# EAGLE design ecu2_telemetria (EAGLE 9.0.0)
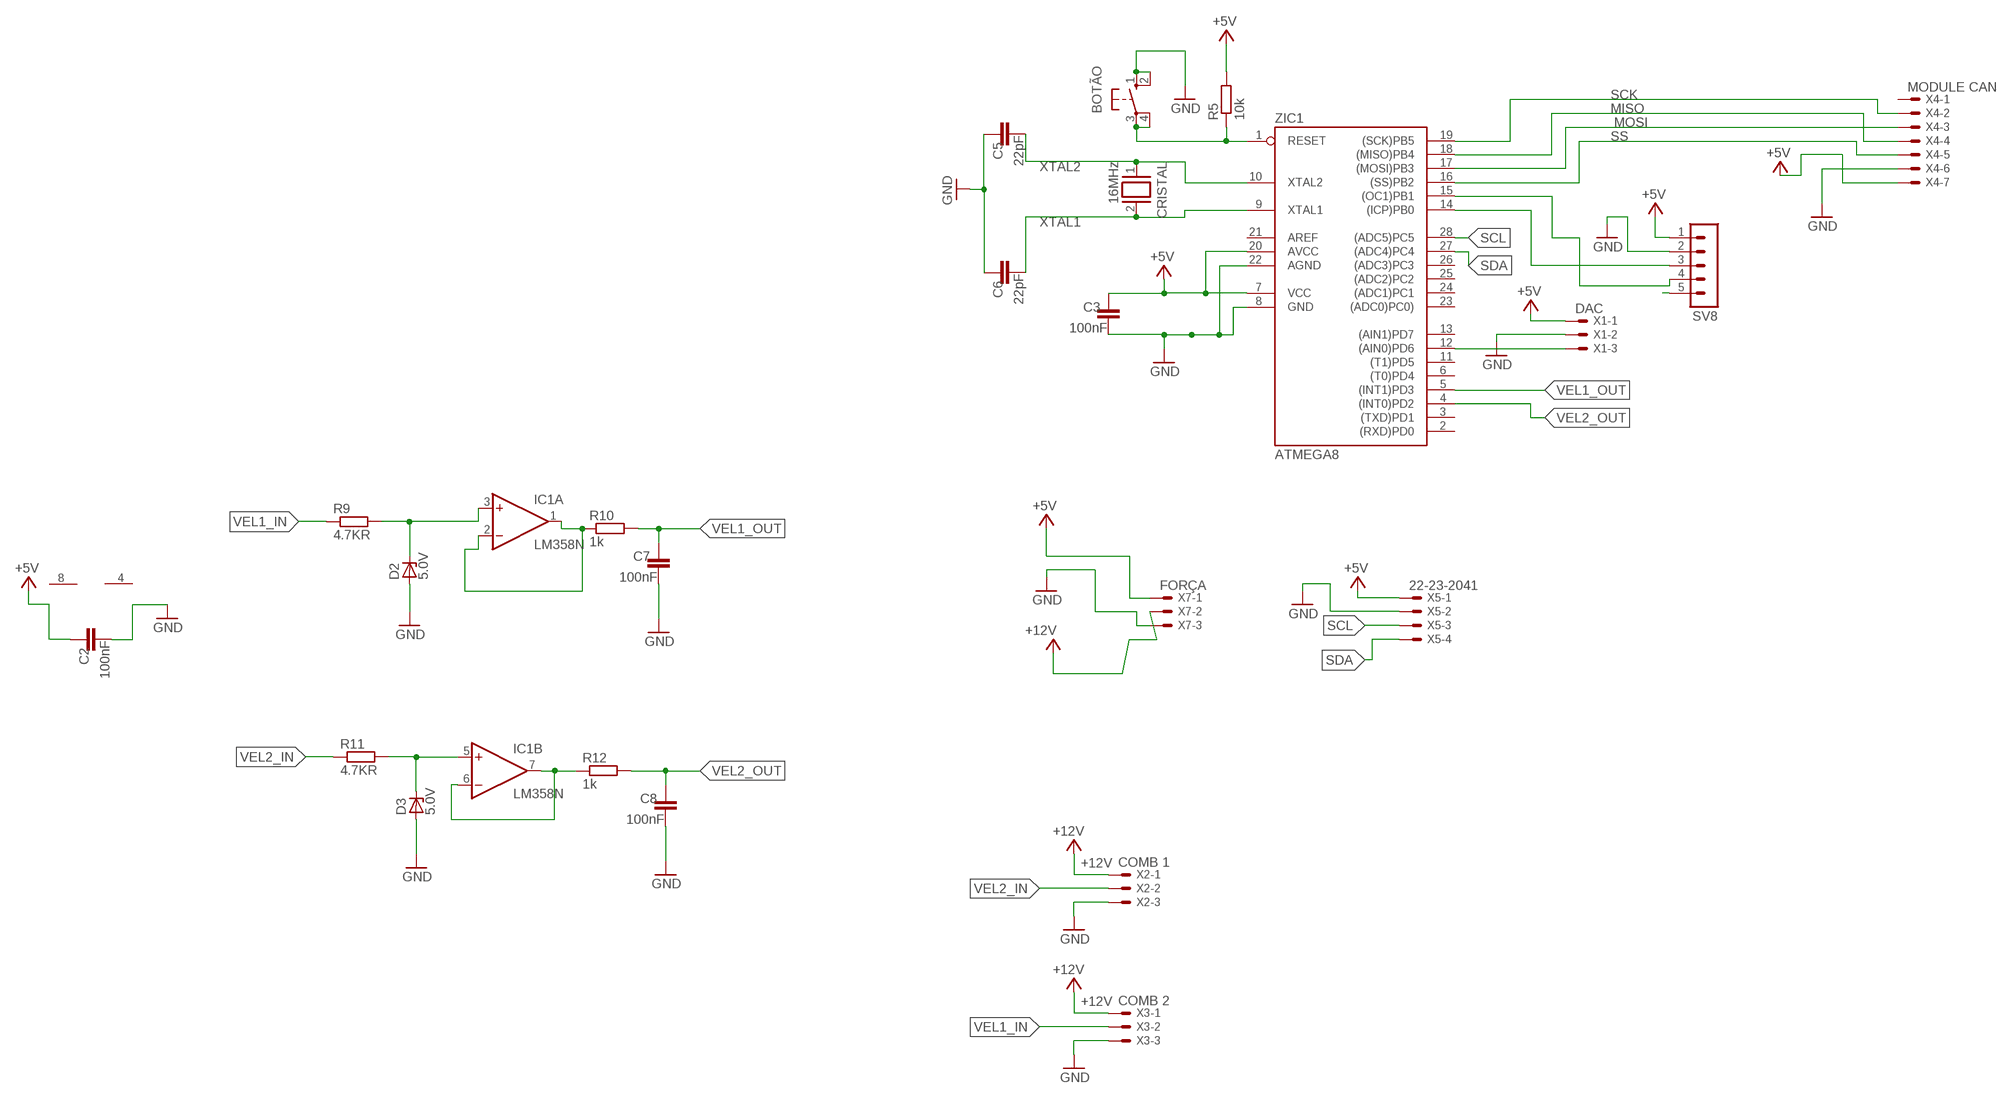
[diagram p0: schematic, sheet 1]

## Parts
BOTÃO  10-XX  [B3F-10XX]
C2  100nF  C5/2.5  [C5B2.5]
C3  100nF  C5/2.5  [C5B2.5]
C5  22pF  C5/2.5  [C5B2.5]
C6  22pF  C5/2.5  [C5B2.5]
C7  100nF  C5/2.5  [C5B2.5]
C8  100nF  C5/2.5  [C5B2.5]
CRISTAL  16MHz  XTAL/S  [QS]
D2  5.0V  ZENER-DIODEDO34-7  [DO34Z7]
D3  5.0V  ZENER-DIODEDO34-7  [DO34Z7]
IC1  LM358N  [DIL08]
R5  10k  R-EU_0207/7  [0207/7]
R9  4.7KR  R-EU_0207/7  [0207/7]
R10  1k  R-EU_0207/7  [0207/7]
R11  4.7KR  R-EU_0207/7  [0207/7]
R12  1k  R-EU_0207/7  [0207/7]
SV8  MA05-1  [MA05-1]
X1  DAC  22-23-2031  [22-23-2031]
X2  COMB 1  22-23-2031  [22-23-2031]
X3  COMB 2  22-23-2031  [22-23-2031]
X4  MODULE CAN  22-23-2071  [22-23-2071]
X5  22-23-2041  [22-23-2041]
X7  FORÇA  22-23-2031  [22-23-2031]
ZIC1  ATMEGA8  AT90S4433P  [DIL28-3]

## Nets
+5V: C2.2 C3.2 R5.2 SV8.1 X1.1 X4.7 X5.1 X7.1 ZIC1.7(VCC) ZIC1.20(AVCC)
+12V: X2.1 X3.1 X7.2
GND: BOTÃO.1(S) BOTÃO.2(S1) C2.1 C3.1 C5.2 C6.2 C7.1 C8.1 D2.A D3.A SV8.2 X1.2 X2.3 X3.3 X4.6 X5.2 X7.3 ZIC1.8(GND) ZIC1.22(AGND)
IO8: SV8.3 ZIC1.14((ICP)PB0)
IO9: SV8.4 ZIC1.15((OC1)PB1)
MISO: X4.4 ZIC1.18((MISO)PB4)
MOSI: X4.3 ZIC1.17((MOSI)PB3)
N$3: X1.3 ZIC1.12((AIN0)PD6)
N$5: D2.C IC1.3(A:+IN) R9.2
N$6: SV8.5
N$9: BOTÃO.3(P) BOTÃO.4(P1) R5.1 ZIC1.1(RESET)
N$12: IC1.1(A:OUT) IC1.2(A:-IN) R10.1
N$13: D3.C IC1.5(B:+IN) R11.2
N$14: IC1.6(B:-IN) IC1.7(B:OUT) R12.1
SCK: X4.2 ZIC1.19((SCK)PB5)
SCL: X5.3 ZIC1.28((ADC5)PC5)
SDA: X5.4 ZIC1.27((ADC4)PC4)
SS: X4.5 ZIC1.16((SS)PB2)
VEL1_IN: R9.1 X3.2
VEL1_OUT: C7.2 R10.2 ZIC1.5((INT1)PD3)
VEL2_IN: R11.1 X2.2
VEL2_OUT: C8.2 R12.2 ZIC1.4((INT0)PD2)
XTAL1: C6.1 CRISTAL.2 ZIC1.9(XTAL1)
XTAL2: C5.1 CRISTAL.1 ZIC1.10(XTAL2)
Unconnected: X4.1 ZIC1.2((RXD)PD0) ZIC1.3((TXD)PD1) ZIC1.6((T0)PD4) ZIC1.11((T1)PD5) ZIC1.13((AIN1)PD7) ZIC1.21(AREF) ZIC1.23((ADC0)PC0)) ZIC1.24((ADC1)PC1) ZIC1.25((ADC2)PC2) ZIC1.26((ADC3)PC3)

## Power pins joined to a net without a drawn wire
V+: IC1.8(P:V+)
V-: IC1.4(P:V-)

## Library data of the parts
BOTÃO = switch-omron:10-XX: OMRON SWITCH; MPN: B3F-1000; OC_FARNELL: 176432; OC_NEWARK: 36M3542
C2 C3 C5-C8 = capacitor-wima:C: CAPACITOR naming: grid - package width
CRISTAL = special:XTAL/S: CRYSTAL
D2 D3 = diode:ZENER-DIODE: Z-Diode
IC1 = linear:LM358: OP AMP also LM158; LM258; LM2904 Source: http://cache.national.com/ds/LM/LM158.pdf
R5 R9-R12 = resistor:R-EU_: RESISTOR, European symbol
SV8 = con-lstb:MA05-1: PIN HEADER; OC_FARNELL: unknown; OC_NEWARK: unknown
X1-X3 X7 = con-molex:22-23-2031: .100" (2.54mm) Center Header - 3 Pin; MF: MOLEX; MPN: 22-23-2031; OC_FARNELL: 1462950; OC_NEWARK: 30C0862
X4 = con-molex:22-23-2071: .100" (2.54mm) Center Header - 7 Pin; MF: MOLEX; MPN: 22-23-2071; OC_FARNELL: 1654534; OC_NEWARK: 56H0445
X5 = con-molex:22-23-2041: .100" (2.54mm) Center Header - 4 Pin; MF: MOLEX; MPN: 22-23-2041; OC_FARNELL: 1462920; OC_NEWARK: 38C0355
ZIC1 = atmel:AT90S4433: MICROCONTROLLER 4 Kbytes FLASH 128 bytes SRAM 256 bytes EEPROM UART 6-channel 10 bit ADC

## Board
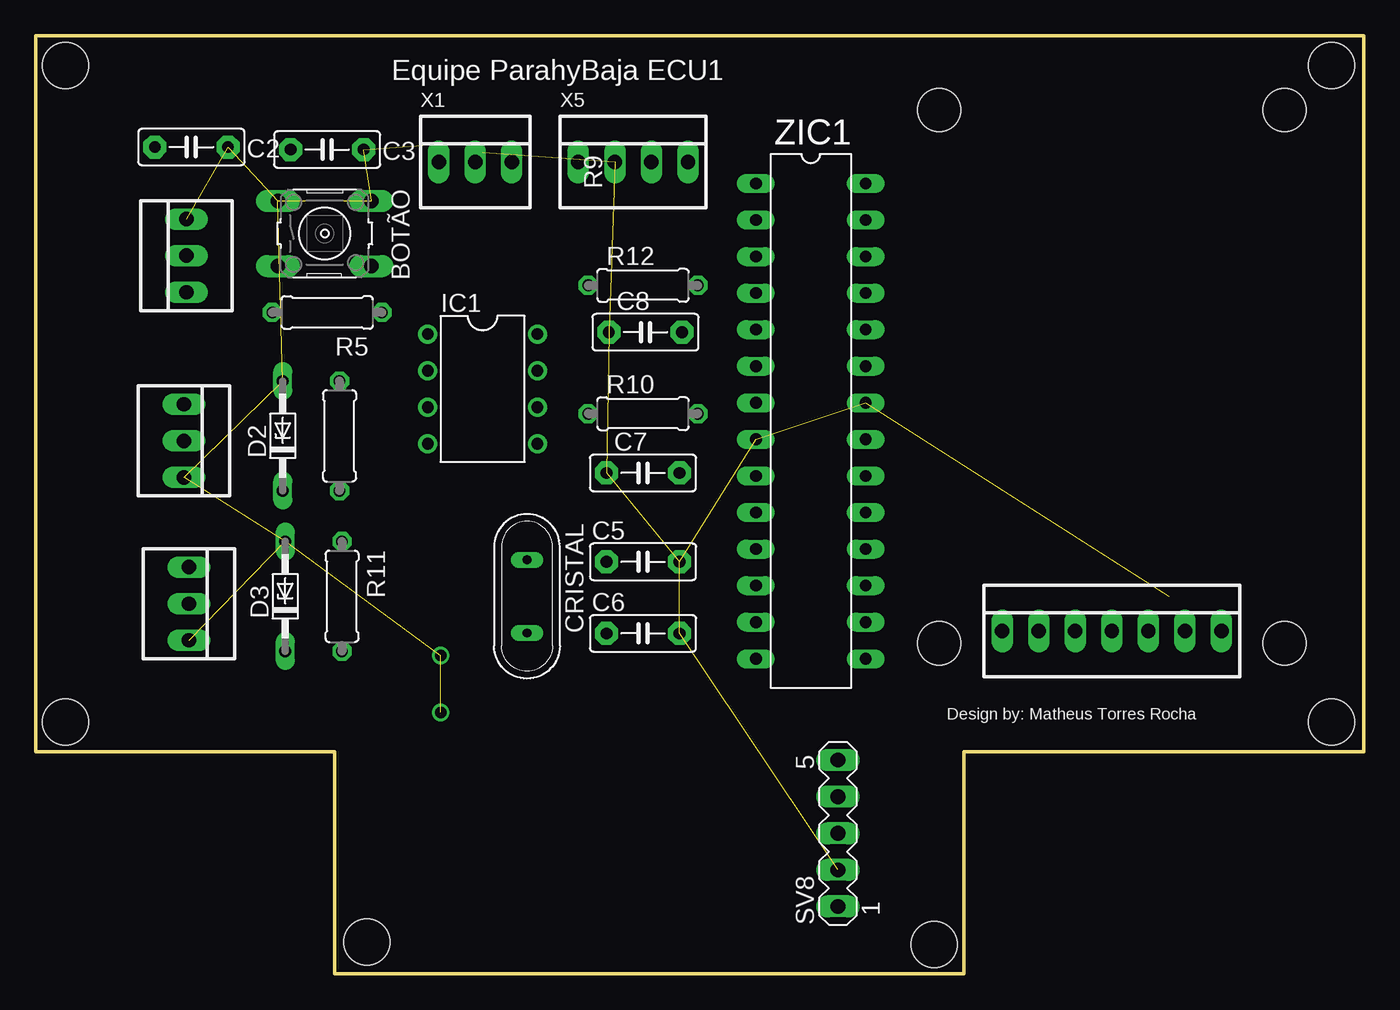
[diagram p1: board, top side]
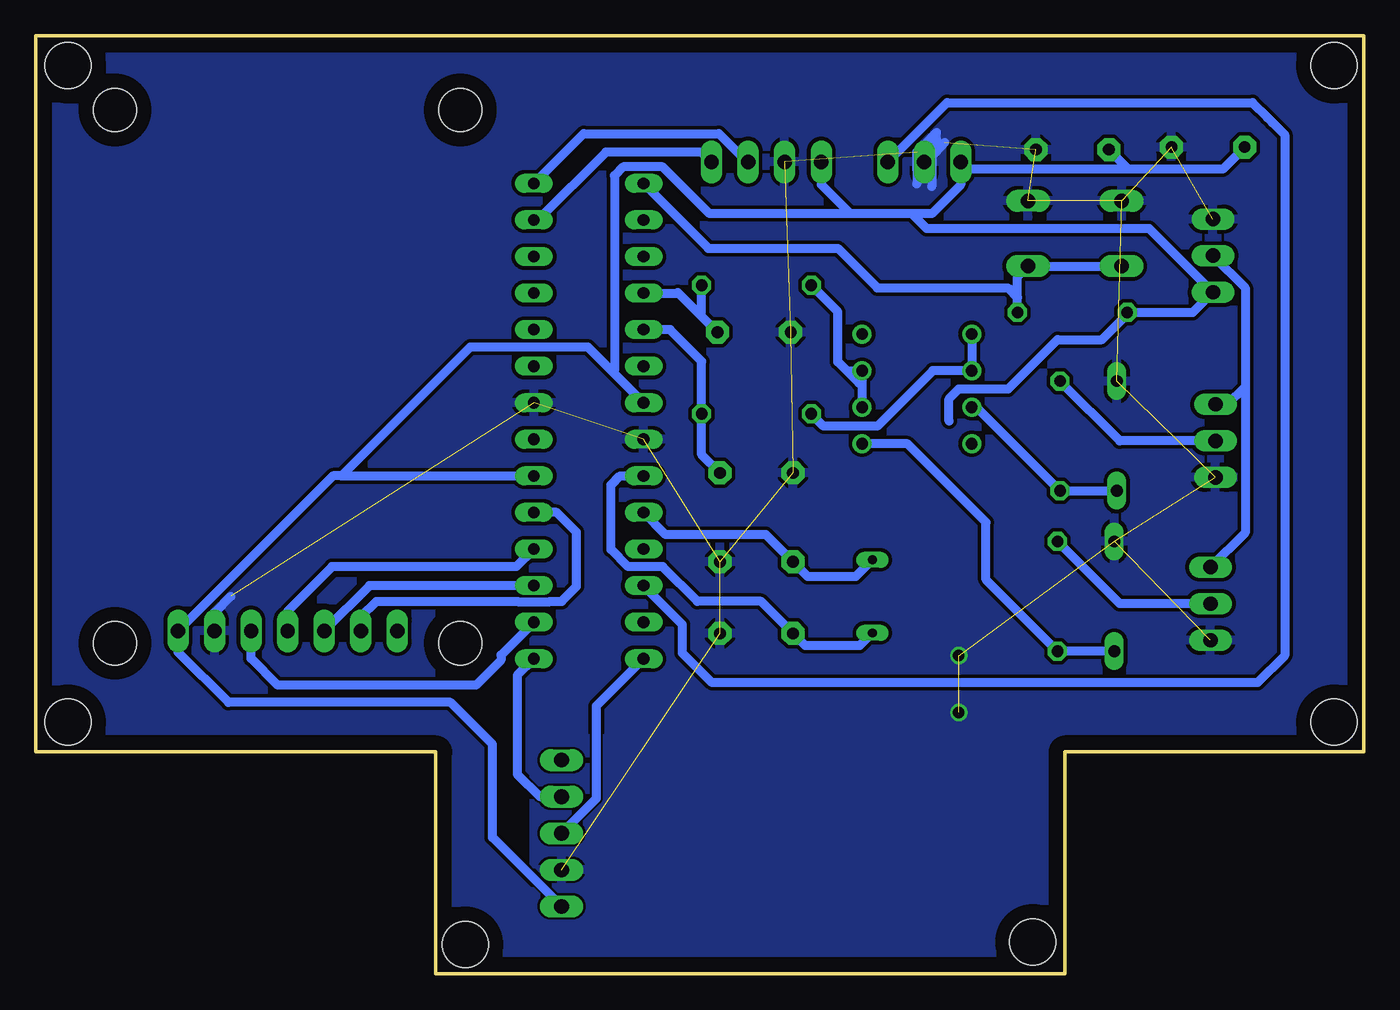
[diagram p2: board, bottom side, seen from below]

Size 92.24 x 65.15 mm. Coordinates in mm from the lower left corner, seen from the top.
Outline: 0,65.15 0,15.43 20.75,15.43 20.75,0 64.47,0 64.47,15.43 92.24,15.43 92.24,65.15 0,65.15
Copper layers (1*16): Top 0.035mm / dielectric 1.5mm / Bottom 0.035mm
Design rules "default": minimum track width 6mil, minimum drill 0.35mm, track to track 6mil, track to pad 6mil, pad to pad 6mil, via to via 6mil, smd to smd 6mil, copper to edge 40mil, drill to drill 6mil, minimum pad ring 10mil, minimum via ring 8mil, stop-mask expansion 4mil, vias tented up to drill 0mil, thermal gap 10mil
Holes 3 mm at 62.75,60.01 86.75,60.01 62.75,22.97 86.75,22.97
Holes 3.2 mm at 2.06,63.09 2.06,17.49 22.97,2.23 62.41,2.06 90.01,17.49 90.01,63.09

### Footprints (pad centres in the part's own frame; a part is rotated, then mirrored left to right if it is on the bottom)
B3F-10XX = drill 1.016 long: 1 -3.251,2.261; 2 3.251,2.261; 3 -3.251,-2.261; 4 3.251,-2.261
C5B2.5 = drill 0.813 pad 1.6 octagon: 1 -2.54,0; 2 2.54,0
QS = drill 0.61 long: 1 -2.54,0; 2 2.54,0
DO34Z7 = drill 0.813 long: A 3.81,0; C -3.81,0
DIL08 = drill 0.813 pad 1.27: 1 -3.81,-3.81; 2 -1.27,-3.81; 3 1.27,-3.81; 4 3.81,-3.81; 5 3.81,3.81; 6 1.27,3.81; 7 -1.27,3.81; 8 -3.81,3.81
0207/7 = drill 0.813 octagon: 1 -3.81,0; 2 3.81,0
MA05-1 = drill 1.016 long: 1 -5.08,0; 2 -2.54,0; 3 0,0; 4 2.54,0; 5 5.08,0
22-23-2031 = drill 1 long: 1 -2.54,0; 2 0,0; 3 2.54,0
22-23-2071 = drill 1 long: 1 -7.62,0; 2 -5.08,0; 3 -2.54,0; 4 0,0; 5 2.54,0; 6 5.08,0; 7 7.62,0
22-23-2041 = drill 1 long: 1 -3.81,0; 2 -1.27,0; 3 1.27,0; 4 3.81,0
DIL28-3 = drill 0.813 long: 1 -16.51,-3.81; 2 -13.97,-3.81; 3 -11.43,-3.81; 4 -8.89,-3.81; 5 -6.35,-3.81; 6 -3.81,-3.81; 7 -1.27,-3.81; 8 1.27,-3.81; 9 3.81,-3.81; 10 6.35,-3.81; 11 8.89,-3.81; 12 11.43,-3.81; 13 13.97,-3.81; 14 16.51,-3.81; 15 16.51,3.81; 16 13.97,3.81; 17 11.43,3.81; 18 8.89,3.81; 19 6.35,3.81; 20 3.81,3.81; 21 1.27,3.81; 22 -1.27,3.81; 23 -3.81,3.81; 24 -6.35,3.81; 25 -8.89,3.81; 26 -11.43,3.81; 27 -13.97,3.81; 28 -16.51,3.81

### Placement (x,y rotation side)
BOTÃO  20.06,51.43 0 top
C2  10.8,57.44 180 top
C3  20.23,57.26 180 top
C5  42.18,28.63 0 top
C6  42.18,23.66 0 top
C7  42.18,34.8 0 top
C8  42.35,44.58 0 top
CRISTAL  34.12,26.23 270 top
D2  17.14,37.38 90 top
D3  17.32,26.23 90 top
IC1  31.03,40.63 270 top
R5  20.23,45.95 180 top
R9  21.09,37.38 270 top
R10  42.18,38.92 0 top
R11  21.26,26.23 270 top
R12  42.18,47.83 0 top
SV8  55.72,9.77 90 top
X1  30.52,56.41 0 top
X2  10.63,25.72 270 top
X3  10.29,37.03 270 top
X4  74.75,23.83 0 top
X5  41.49,56.41 0 top
X7  10.46,49.89 90 top
ZIC1  53.84,38.41 270 top

### Tracks (layer width: path | path; a pad name or v marks a point on that pad's centre or on a via)
+5V
  Bottom 0.61: 58.16,34.6 ZIC1.20 71.02,34.6 | SV8.1 60.52,9.49 60.52,15.95 63.44,18.86 78.87,18.86 82.37,22.36 X4.7 71.61,34.6 71.02,34.6 | 28.8,38.41 28.8,39.95 28.12,40.63 24.69,40.63 21.26,44.06 18.17,44.06 16.42,45.82 R5.2 11.86,45.95 X7.1 14.88,51.78 30.35,51.78 31.38,52.81 | C2.2 9.79,55.91 16.34,55.91 | 16.34,55.91 C3.2 | 16.34,55.91 27.48,55.91 X1.1 27.98,54.83 30,52.81 31.38,52.81 | 31.38,52.81 35.66,52.81 | 35.66,52.81 45.43,52.81 48.69,56.06 51.44,56.06 52.05,55.45 52.05,41.9 52.15,41.8 | X5.1 37.68,54.83 35.66,52.81 | ZIC1.7 52.15,41.8 | 52.15,41.8 53.9,43.55 62.06,43.55 71.02,34.6
+12V
  Bottom 0.61: X7.2 8.23,47.66 8.23,40.81 | 8.23,40.81 9.46,39.57 X3.1 | 8.23,40.81 8.23,30.66 X2.1
GND  (via drill 0.8)  (20 unrouted)
  Bottom 0.61: 78.7,26.23 79.83,25.1 X4.6 | 30.52,57.61 29.66,58.46 29.66,57.95 30.52,57.09 X1.2 | X1.2 29.32,57.61 29.24,57.61 | 29.24,57.61 29.11,57.74 | 29.24,57.61 30,56.85 | 30,56.85 30,54.69 | 30,56.85 30,57.09 30.52,57.61 | X1.2 31.03,55.89 | 31.03,55.89 31.03,54.86 | 31.03,55.89 31.03,57.09 30.52,57.61
  other vias: 28.12,22.12 28.12,18.17
  pour Bottom (isolate 0.254): 1.54,65.15 92.24,65.15 92.24,15.6 92.24,15.43 64.47,15.43 64.47,0 20.75,0 20.75,15.43 0,15.43 0,65.15 1.37,65.15
IO8
  Bottom 0.61: ZIC1.14 53.32,18.6 53.32,12.17 SV8.3
IO9
  Bottom 0.61: ZIC1.15 58.81,20.73 58.81,13.89 57.23,12.31 SV8.4
MISO
  Bottom 0.61: ZIC1.18 58.87,28.29 71.67,28.29 74.75,25.2 X4.4
MODULE_CAN
  pour Bottom (isolate 0.406): 60.86,21.09 88.64,21.09 88.64,61.89 60.86,61.89
MOSI
  Bottom 0.61: ZIC1.17 69.07,26.98 X4.3
N$1
  pour Bottom: 57.78,2.74 26.92,2.74 26.92,16.46 57.78,16.46
N$3
  Bottom 0.61: ZIC1.12 47.32,24.27 47.32,22.29 45.26,20.23 7.37,20.23 5.49,22.12 5.49,58.29 6.34,59.15 6.69,59.49 7.72,60.52 28.94,60.52 X1.3
N$5
  Bottom 0.61: D2.C R9.2 26.89,39.36 IC1.3
N$9
  Bottom 0.61: R5.1 24.04,46.98 | 24.04,46.98 24.04,48.44 BOTÃO.4 BOTÃO.3 | ZIC1.1 45.52,50.41 36.52,50.41 33.78,47.66 24.73,47.66 24.04,46.98
N$12
  Bottom 0.61: IC1.1 IC1.2 29.93,41.9 33.78,38.06 37.51,38.06 R10.1
N$13
  Bottom 0.61: IC1.5 31.68,36.82 26.23,31.38 26.23,27.39 R11.2 D3.C
N$14
  Bottom 0.61: 35.9,41.9 36.52,42.52 36.52,45.99 R12.1 | 35.9,41.9 IC1.7 | 35.9,41.9 35.06,41.06 | 35.06,41.06 34.84,40.84 | 34.84,40.84 IC1.6 | IC1.7 35.06,41.69 35.06,41.06 | IC1.7 34.84,40.84
SCK
  Bottom 0.61: X4.2 69.67,24.8 68.58,25.89 58.8,25.89 58.77,25.86 56.52,25.86 56.49,25.89 55.72,25.89 54.69,26.92 54.69,30.69 56.06,32.06 ZIC1.19
SCL
  Bottom 0.61: X5.3 42.83,56.41 44.8,58.37 54.19,58.37 ZIC1.28
SDA
  Bottom 0.61: X5.4 45.99,57.09 52.64,57.09 57.35,52.38 ZIC1.27
SS
  Bottom 0.61: ZIC1.16 59.93,22.15 59.93,21.81 61.68,20.06 75.44,20.06 77.29,21.91 X4.5
VEL1_IN
  Bottom 0.61: X3.2 16.94,37.03 R9.1
VEL1_OUT
  Bottom 0.61: C7.2 45.99,36.08 R10.2 45.99,42.56 48.18,44.76 ZIC1.5
VEL2_IN
  Bottom 0.61: X2.2 16.94,25.72 R11.1
VEL2_OUT
  Bottom 0.61: C8.2 45.99,45.68 | 45.99,45.68 R12.2 | ZIC1.4 47.69,47.3 47.66,47.32 47.63,47.32 45.99,45.68
XTAL1
  Bottom 0.61: ZIC1.9 51.64,34.6 52.29,33.95 52.29,29.49 51.09,28.29 48.69,28.29 46.29,25.89 41.87,25.89 39.88,23.9 C6.1 38.78,22.8 35.01,22.8 CRISTAL.2
XTAL2
  Bottom 0.61: ZIC1.10 48.49,30.52 41.52,30.52 C5.1 38.61,27.6 35.29,27.6 CRISTAL.1

### Text on the board
tNames: Equipe ParahyBaja ECU1 | Design by: Matheus Torres Rocha